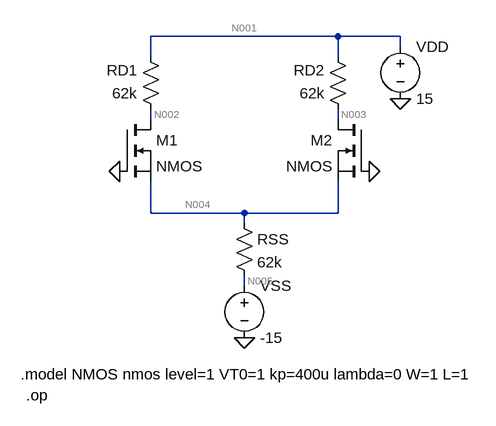
[diagram p0: schematic pag18es7.asc]
pag18es7.asc, the LTspice schematic file:
Version 4
SHEET 1 880 680
WIRE 384 16 96 16
WIRE 480 16 384 16
WIRE 480 32 480 16
WIRE 96 48 96 16
WIRE 384 48 384 16
WIRE 96 144 96 128
WIRE 384 144 384 128
WIRE 96 288 96 240
WIRE 240 288 96 288
WIRE 384 288 384 240
WIRE 384 288 240 288
WIRE 240 304 240 288
WIRE 240 400 240 384
FLAG 240 480 0
FLAG 48 224 0
FLAG 432 224 0
FLAG 480 112 0
SYMBOL nmos 48 144 R0
SYMATTR InstName M1
SYMBOL nmos 432 144 M0
SYMATTR InstName M2
SYMBOL res 224 288 R0
SYMATTR InstName RSS
SYMATTR Value 62k
SYMBOL voltage 240 384 R0
SYMATTR InstName VSS
SYMATTR Value -15
SYMBOL res 112 144 R180
WINDOW 0 36 76 Left 2
WINDOW 3 36 40 Left 2
SYMATTR InstName RD1
SYMATTR Value 62k
SYMBOL res 400 144 R180
WINDOW 0 36 76 Left 2
WINDOW 3 36 40 Left 2
SYMATTR InstName RD2
SYMATTR Value 62k
SYMBOL voltage 480 16 R0
SYMATTR InstName VDD
SYMATTR Value 15
TEXT -104 536 Left 2 !.model NMOS nmos level=1 VT0=1 kp=400u lambda=0 W=1 L=1
TEXT -96 568 Left 2 !.op

The netlist it stands for:
* pag18es7.asc
M1 N002 0 N004 N004 NMOS
M2 N003 0 N004 N004 NMOS
RSS N004 N005 62k
VSS N005 0 -15
RD1 N002 N001 62k
RD2 N003 N001 62k
VDD N001 0 15
.model NMOS NMOS
.model PMOS PMOS
.lib standard.mos
.model NMOS nmos level=1 VT0=1 kp=400u lambda=0 W=1 L=1
.op
.backanno
.end

* Results of the author's LTspice run, read from the files saved beside the schematic
* Operating Point:
*   V(n002) = 8.366 V
*   V(n004) = -1.731 V
*   V(n003) = 8.366 V
*   V(n005) = -15 V
*   V(n001) = 15 V
*   Id(M2) = 107 µA
*   Ig(M2) = 0 A
*   Ib(M2) = -10.11 pA
*   Is(M2) = -107 µA
*   Id(M1) = 107 µA
*   Ig(M1) = 0 A
*   Ib(M1) = -10.11 pA
*   Is(M1) = -107 µA
*   I(Rd2) = -107 µA
*   I(Rd1) = -107 µA
*   I(Rss) = 214 µA
*   I(Vdd) = -214 µA
*   I(Vss) = 214 µA
* From the log:
*   Semiconductor Device Operating Points:
*                           --- MOSFET Transistors ---
*   Name:          m2          m1
*   Model:        nmos        nmos
*   Id:          1.07e-04    1.07e-04
*   Vgs:         1.73e+00    1.73e+00
*   Vds:         1.01e+01    1.01e+01
*   Vbs:         0.00e+00    0.00e+00
*   Vth:         1.00e+00    1.00e+00
*   Vdsat:       7.31e-01    7.31e-01
*   Gm:          2.93e-04    2.93e-04
*   Gds:         0.00e+00    0.00e+00
*   Gmb:         0.00e+00    0.00e+00
*   Cbd:         0.00e+00    0.00e+00
*   Cbs:         0.00e+00    0.00e+00
*   Cgsov:       0.00e+00    0.00e+00
*   Cgdov:       0.00e+00    0.00e+00
*   Cgbov:       0.00e+00    0.00e+00
*   Cgs:         0.00e+00    0.00e+00
*   Cgd:         0.00e+00    0.00e+00
*   Cgb:         0.00e+00    0.00e+00